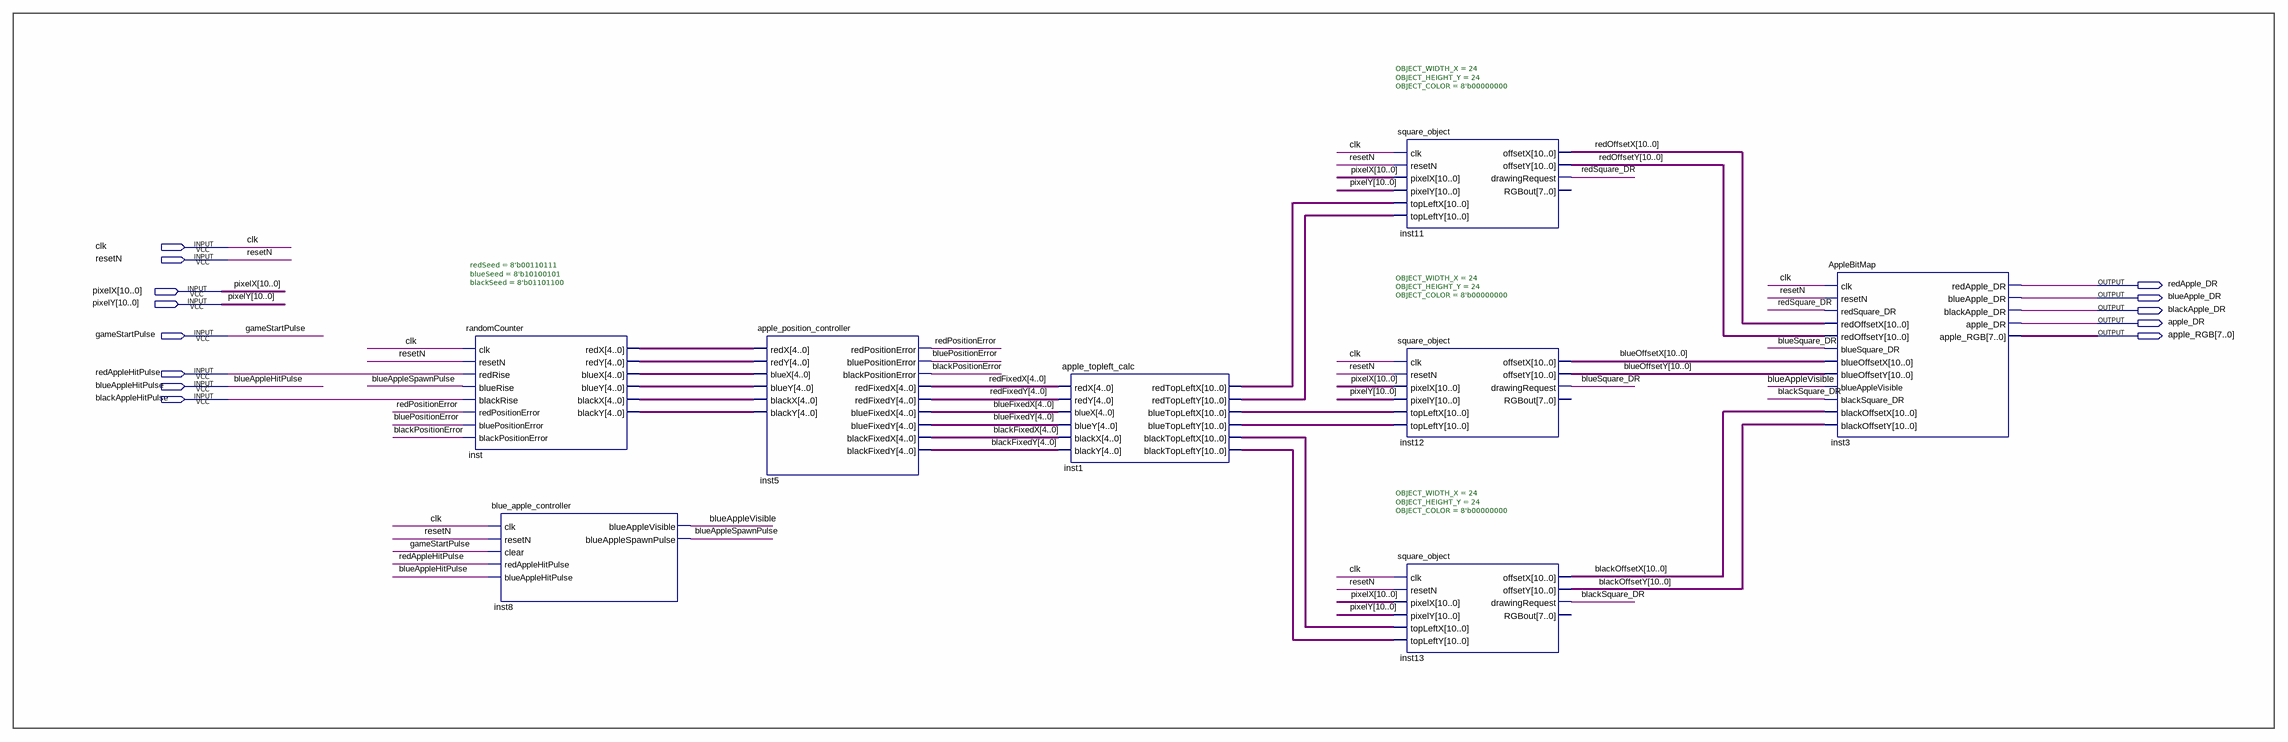
[diagram p0: schematic sheet]
// Quartus schematic Apple_Block.bdf as structural Verilog: 8 symbols, 13 pins
module Apple_Block (
  input  clk,
  input  resetN,
  input  [10:0] pixelX,
  input  [10:0] pixelY,
  input  gameStartPulse,
  input  redAppleHitPulse,
  input  blueAppleHitPulse,
  input  blackAppleHitPulse,
  output redApple_DR,
  output blueApple_DR,
  output blackApple_DR,
  output apple_DR,
  output [7:0] apple_RGB
);

  wire blackPositionError, blackSquare_DR, blueAppleSpawnPulse, blueAppleVisible, bluePositionError,
       blueSquare_DR, redPositionError, redSquare_DR;
  wire [4:0] blackFixedX, blackFixedY, blueFixedX, blueFixedY, inst_blackx, inst_blacky, inst_bluex,
       inst_bluey, inst_redx, inst_redy, redFixedX, redFixedY;
  wire [10:0] blackOffsetX, blackOffsetY, blueOffsetX, blueOffsetY, inst1_blacktopleftx, inst1_blacktoplefty,
       inst1_bluetopleftx, inst1_bluetoplefty, inst1_redtopleftx, inst1_redtoplefty, redOffsetX, redOffsetY;

  randomCounter #(.redSeed(8'b00110111), .blueSeed(8'b10100101), .blackSeed(8'b01101100)) inst (
    .clk(clk), .resetN(resetN), .redRise(redAppleHitPulse), .blueRise(blueAppleSpawnPulse),
    .blackRise(blackAppleHitPulse), .redPositionError(redPositionError),
    .bluePositionError(bluePositionError), .blackPositionError(blackPositionError), .redX(inst_redx),
    .redY(inst_redy), .blueX(inst_bluex), .blueY(inst_bluey), .blackX(inst_blackx), .blackY(inst_blacky));
  blue_apple_controller inst8 (
    .clk(clk), .resetN(resetN), .clear(gameStartPulse), .redAppleHitPulse(redAppleHitPulse),
    .blueAppleHitPulse(blueAppleHitPulse), .blueAppleVisible(blueAppleVisible),
    .blueAppleSpawnPulse(blueAppleSpawnPulse));
  apple_position_controller inst5 (
    .redX(inst_redx), .redY(inst_redy), .blueX(inst_bluex), .blueY(inst_bluey), .blackX(inst_blackx),
    .blackY(inst_blacky), .redPositionError(redPositionError), .bluePositionError(bluePositionError),
    .blackPositionError(blackPositionError), .redFixedX(redFixedX), .redFixedY(redFixedY),
    .blueFixedX(blueFixedX), .blueFixedY(blueFixedY), .blackFixedX(blackFixedX), .blackFixedY(blackFixedY));
  apple_topleft_calc inst1 (
    .redX(redFixedX), .redY(redFixedY), .blueX(blueFixedX), .blueY(blueFixedY), .blackX(blackFixedX),
    .blackY(blackFixedY), .redTopLeftX(inst1_redtopleftx), .redTopLeftY(inst1_redtoplefty),
    .blueTopLeftX(inst1_bluetopleftx), .blueTopLeftY(inst1_bluetoplefty),
    .blackTopLeftX(inst1_blacktopleftx), .blackTopLeftY(inst1_blacktoplefty));
  square_object #(.OBJECT_WIDTH_X(24), .OBJECT_HEIGHT_Y(24), .OBJECT_COLOR(8'b00000000)) inst11 (
    .clk(clk), .resetN(resetN), .pixelX(pixelX), .pixelY(pixelY), .topLeftX(inst1_redtopleftx),
    .topLeftY(inst1_redtoplefty), .offsetX(redOffsetX), .offsetY(redOffsetY), .drawingRequest(redSquare_DR));  // open: RGBout
  square_object #(.OBJECT_WIDTH_X(24), .OBJECT_HEIGHT_Y(24), .OBJECT_COLOR(8'b00000000)) inst12 (
    .clk(clk), .resetN(resetN), .pixelX(pixelX), .pixelY(pixelY), .topLeftX(inst1_bluetopleftx),
    .topLeftY(inst1_bluetoplefty), .offsetX(blueOffsetX), .offsetY(blueOffsetY),
    .drawingRequest(blueSquare_DR));  // open: RGBout
  square_object #(.OBJECT_WIDTH_X(24), .OBJECT_HEIGHT_Y(24), .OBJECT_COLOR(8'b00000000)) inst13 (
    .clk(clk), .resetN(resetN), .pixelX(pixelX), .pixelY(pixelY), .topLeftX(inst1_blacktopleftx),
    .topLeftY(inst1_blacktoplefty), .offsetX(blackOffsetX), .offsetY(blackOffsetY),
    .drawingRequest(blackSquare_DR));  // open: RGBout
  AppleBitMap inst3 (
    .clk(clk), .resetN(resetN), .redSquare_DR(redSquare_DR), .redOffsetX(redOffsetX),
    .redOffsetY(redOffsetY), .blueSquare_DR(blueSquare_DR), .blueOffsetX(blueOffsetX),
    .blueOffsetY(blueOffsetY), .blueAppleVisible(blueAppleVisible), .blackSquare_DR(blackSquare_DR),
    .blackOffsetX(blackOffsetX), .blackOffsetY(blackOffsetY), .redApple_DR(redApple_DR),
    .blueApple_DR(blueApple_DR), .blackApple_DR(blackApple_DR), .apple_DR(apple_DR), .apple_RGB(apple_RGB));
endmodule
